# Altium schematic sheet Switchboard_node.SchDoc
size A4
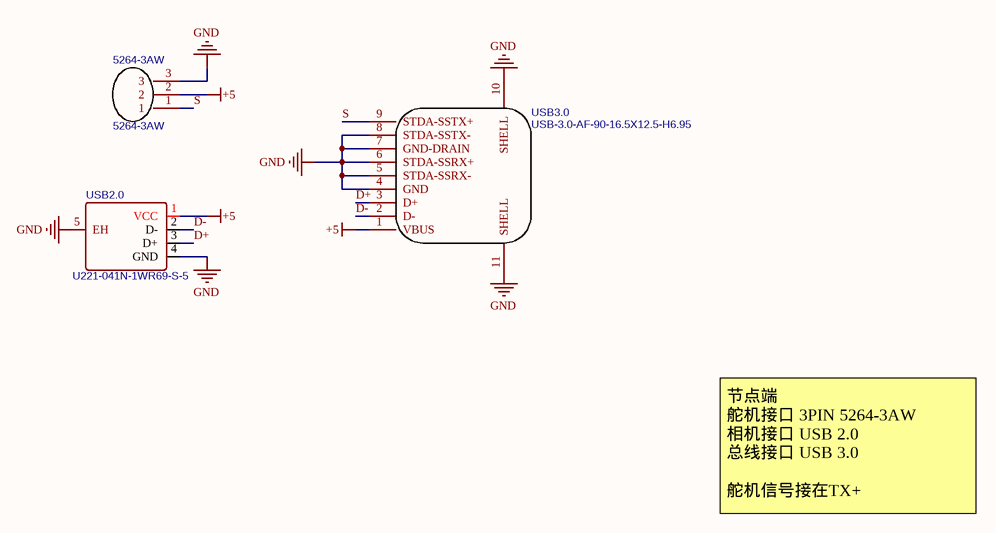
[diagram p0: Switchboard_node.SchDoc]

## Parts
5264-3AW  5264-3AW  [CONN-TH_5264-3AW]
USB2.0  U221-041N-1WR69-S-5  [USB-A-TH_U221-041N-1WR69-S-5]
USB3.0  USB-3.0-AF-90-16.5X12.5-H6.95  [USB-3.0-TH_C69073]

## Nets
+5: 5264-3AW.2 USB2.0.1(VCC) USB3.0.1(VBUS)
GND: 5264-3AW.3 USB2.0.4(GND) USB2.0.5(EH) USB3.0.4(GND) USB3.0.5(STDA-SSRX-) USB3.0.6(STDA-SSRX+) USB3.0.7(GND-DRAIN) USB3.0.8(STDA-SSTX-) USB3.0.10(SHELL) USB3.0.11(SHELL)
D+: USB2.0.3(D+) USB3.0.3(D+)
D-: USB2.0.2(D-) USB3.0.2(D-)
S: 5264-3AW.1 USB3.0.9(STDA-SSTX+)

## Notes on the sheet
- 节点端
  舵机接口 3PIN 5264-3AW
  相机接口 USB 2.0
  总线接口 USB 3.0
  舵机信号接在TX+

## Library data of the parts
5264-3AW = 5264-3AW: BOM_Manufacturer: ReliaPro; BOM_Paste Type: expand; BOM_Supplier: LCSC; BOM_Manufacturer Part: 5264-3AW; BOM_Supplier Part: C48374; spicePre: C; spiceSymbolName: 5264-3AW
USB2.0 = U221-041N-1WR69-S-5: BOM_Manufacturer: XKB Connectivity; Contributor: LCSC; BOM_Supplier: LCSC; BOM_Supplier Part: C725877; BOM_Manufacturer Part: U221-041N-1WR69-S-5; spicePre: U; spiceSymbolName: U221-041N-1WR69-S-5
USB3.0 = USB-3.0-AF-90-16.5X12.5-H6.95: BOM_Manufacturer: LCSC; BOM_Paste Type: expand; BOM_Supplier: LCSC; BOM_Supplier Part: C69073; BOM_Manufacturer Part: USB-3.0-AF-90-16.5X12.5-H6.95; Contributor: LCSC; spicePre: U; spiceSymbolName: USB-3.0-AF-90-16.5X12.5-H6.95